# Altium schematic sheet Slave_2_relays.SchDoc
size Legal
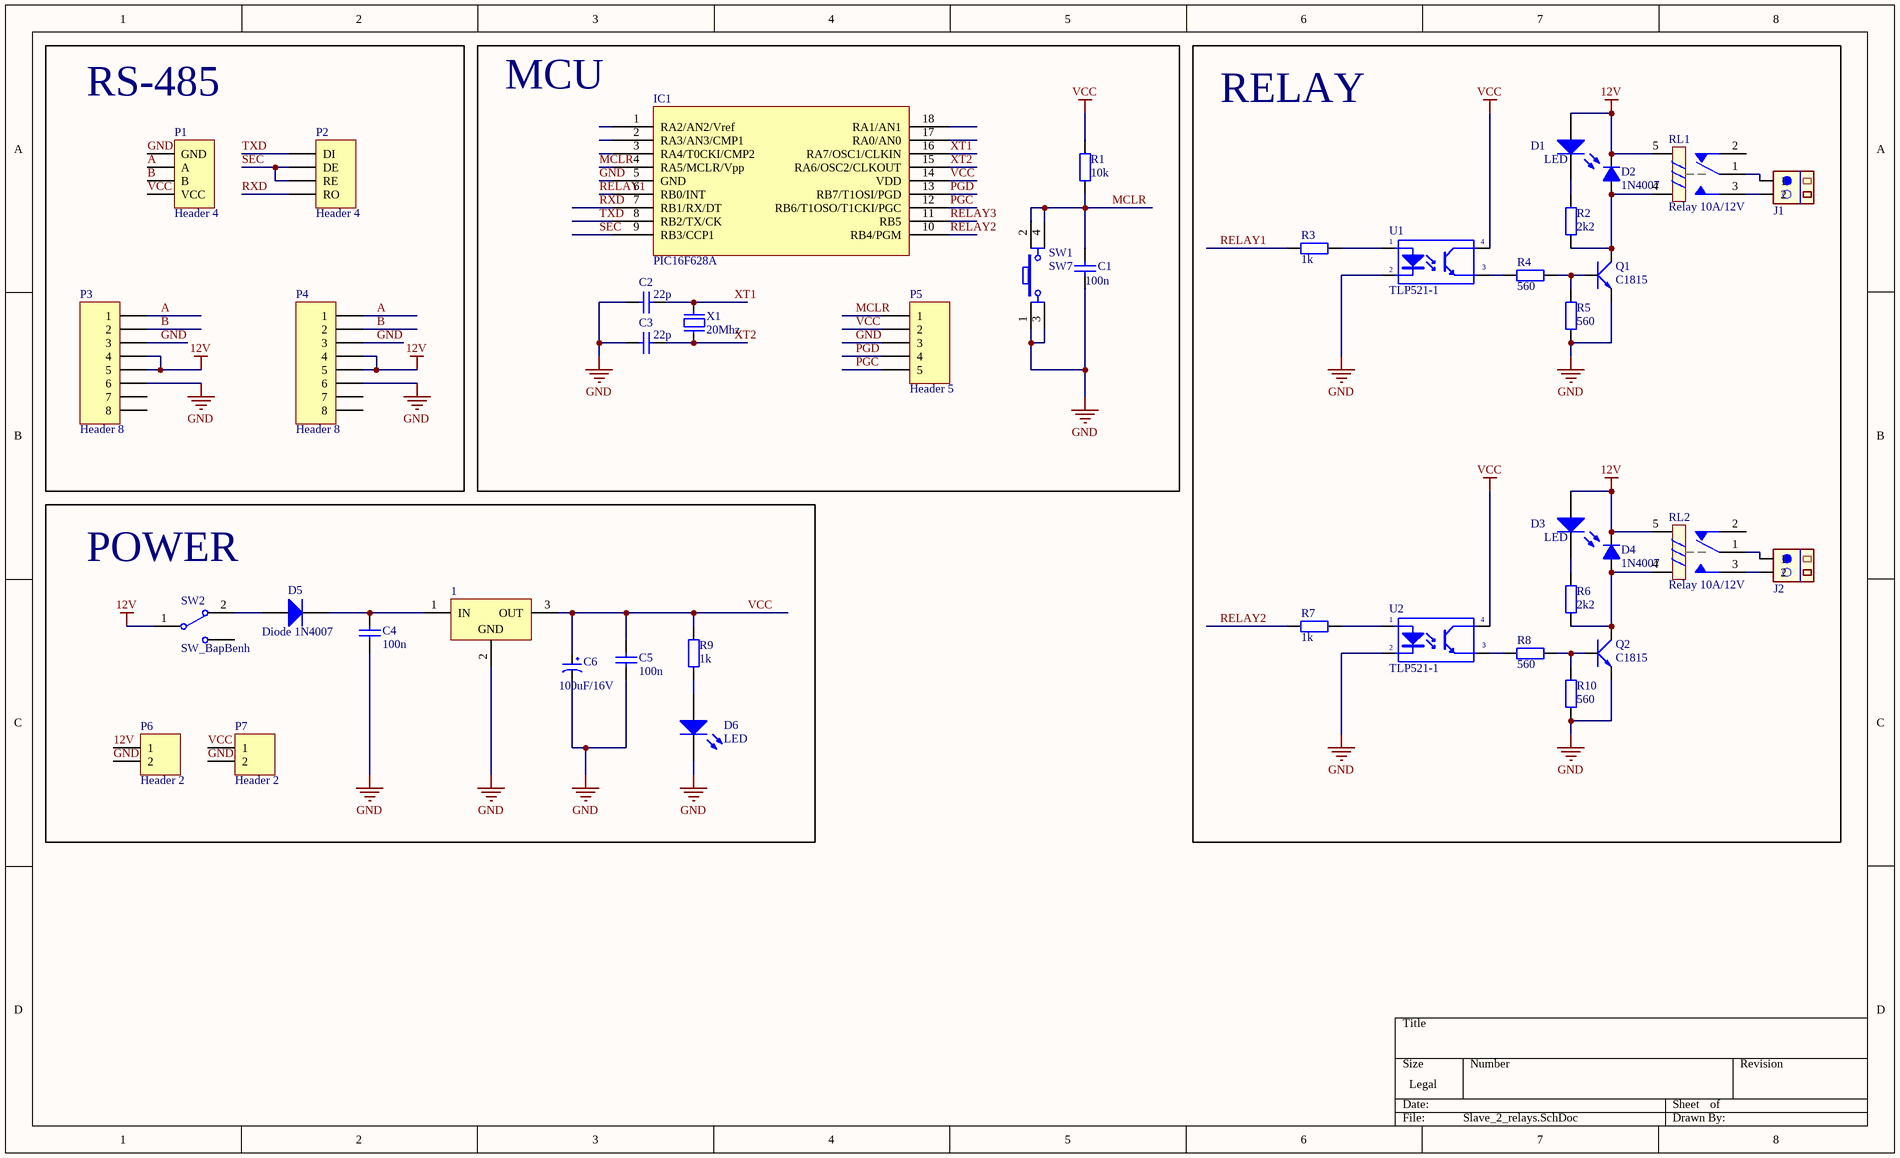
[diagram p0: Slave_2_relays.SchDoc]

## Parts
1  L78M05CP  [QTO-220]  (value not drawn)
C1  value 100n  [Cap Non-Pol 3mm]  (hidden comment: Capacitor Ceramic)
C2  value 22p  [Cap Non-Pol 3mm]  (hidden comment: Cap Non-pol)
C3  value 22p  [Cap Non-Pol 3mm]  (hidden comment: Cap Non-pol)
C4  value 100n  [Cap Non-Pol 3mm]  (hidden comment: Cap Non-pol)
C5  value 100n  [Cap Non-Pol 3mm]  (hidden comment: Cap Non-pol)
C6  100uF/16V  [CP1.5/3.4]
D1  LED  [LED-0 5mm RED]
D2  1N4007  [D1A]
D3  LED  [LED-0 5mm RED]
D4  1N4007  [D1A]
D5  Diode 1N4007  [DO-41]
D6  LED  [LED-5mm RED]
IC1  PIC16F628A  [DIP18/W0.3]
J1  CON.Domino2  [DOMINO 2B]  (value not drawn)
J2  CON.Domino2  [DOMINO 2B]  (value not drawn)
P1  Header 4  [HDR1X4]
P2  Header 4  [HDR1X4]
P3  Header 8  [RJ11]
P4  Header 8  [RJ11]
P5  Header 5  [Header 5]
P6  Header 2  [HDR1X2]
P7  Header 2  [HDR1X2]
Q1  C1815  [QTO-92]
Q2  C1815  [QTO-92]
R1  value 10k  [RESISTOR 1/4W]  (hidden comment: RES_SMD_0805)
R2  value 2k2  [RESISTOR 1/4W]  (hidden comment: RES_SMD_0805)
R3  value 1k  [RESISTOR 1/4W]  (hidden comment: RES_SMD_0805)
R4  value 560  [RESISTOR 1/4W]  (hidden comment: RES_SMD_0805)
R5  value 560  [RESISTOR 1/4W]  (hidden comment: RES_SMD_0805)
R6  value 2k2  [RESISTOR 1/4W]  (hidden comment: RES_SMD_0805)
R7  value 1k  [RESISTOR 1/4W]  (hidden comment: RES_SMD_0805)
R8  value 560  [RESISTOR 1/4W]  (hidden comment: RES_SMD_0805)
R9  value 1k  [RESISTOR 1/4W]  (hidden comment: RES_SMD_0805)
R10  value 560  [RESISTOR 1/4W]  (hidden comment: RES_SMD_0805)
RL1  Relay 10A/12V  [RL_SPDT_10A]
RL2  Relay 10A/12V  [RL_SPDT_10A]
SW1  SW7  [SW4]
SW2  SW_BapBenh  [SW_Bapbenh]
U1  TLP521-1  [DIP4/W0.3]
U2  TLP521-1  [DIP4/W0.3]
X1  20Mhz  [XT2]

## Blocks framed on the sheet
RS-485: P1-P4
MCU: C1-C3 IC1 P5 R1 SW1 X1
RELAY: D1-D4 J1 J2 Q1 Q2 R2-R8 R10 RL1 RL2 U1 U2
POWER: 1 C4-C6 D5 D6 P6 P7 R9 SW2

## Nets
12V: D1.1(A) D2.2(K) D3.1(A) D4.2(K) P3.4 P3.5 P4.4 P4.5 P6.1 RL1.5 RL2.5 SW2.1
GND: 1.2(GND) C1.1 C2.2 C3.2 C4.1 C5.1 C6.2 D6.2(K) IC1.5(GND) P1.1(GND) P3.3 P3.6 P4.3 P4.6 P5.3 P6.2 P7.2 Q1.1(E) Q2.1(E) R5.2 R10.2 SW1.1 SW1.3 U1.2(K) U2.2(K)
VCC: 1.3(OUT) C5.2 C6.1 IC1.14(VDD) P1.4(VCC) P5.2 P7.1 R1.2 R9.2 U1.4(C) U2.4(C)
A: P1.2(A) P3.1 P4.1
B: P1.3(B) P3.2 P4.2
MCLR: C1.2 IC1.4(RA5/MCLR/Vpp) P5.1 R1.1 SW1.2 SW1.4
PGC: IC1.12(RB6/T1OSO/T1CKI/PGC) P5.5
PGD: IC1.13(RB7/T1OSI/PGD) P5.4
RELAY1: IC1.6(RB0/INT) R3.2
RELAY2: IC1.10(RB4/PGM) R7.2
RELAY3: IC1.11(RB5)
RXD: IC1.7(RB1/RX/DT) P2.4(RO)
SEC: IC1.9(RB3/CCP1) P2.2(DE) P2.3(RE)
TXD: IC1.8(RB2/TX/CK) P2.1(DI)
XT1: C2.1 IC1.16(RA7/OSC1/CLKIN) X1.2
XT2: C3.1 IC1.15(RA6/OSC2/CLKOUT) X1.1
Net1_1: 1.1(IN) C4.2 D5.2(K)
NetD1_2: D1.2(K) R2.1
NetD2_1: D2.1(A) Q1.2(C) R2.2 RL1.4
NetD3_2: D3.2(K) R6.1
NetD4_1: D4.1(A) Q2.2(C) R6.2 RL2.4
NetD5_1: D5.1(A) SW2.2
NetD6_1: D6.1(A) R9.1
NetJ1_1: J1.1 RL1.1
NetJ1_2: J1.2 RL1.3
NetJ2_1: J2.1 RL2.1
NetJ2_2: J2.2 RL2.3
NetQ1_3: Q1.3(B) R4.1 R5.1
NetQ2_3: Q2.3(B) R8.1 R10.1
NetR3_1: R3.1 U1.1(A)
NetR4_2: R4.2 U1.3(E)
NetR7_1: R7.1 U2.1(A)
NetR8_2: R8.2 U2.3(E)

Not connected (* = marked no-connect by the designer): IC1 1(RA2/AN2/Vref) 2(RA3/AN3/CMP1) 3(RA4/T0CKI/CMP2) 17(RA0/AN0) 18(RA1/AN1); P3 7 8; P4 7 8; RL1 2; RL2 2

## Library data of the parts
1 = L78M05CP: Positive Voltage Regulator; Note: Tab is connected to pin 3 (GND).; Published: 24-Aug-2001; LatestRevisionDate: 17-Jul-2002; LatestRevisionNote: Re-released for DXP Platform.; DatasheetVersion: Apr-1994; PackageVersion: Jul-1998; PackageReference: ISOWATT220AB; Publisher: Altium Limited; PackageDescription: TO, Thru-Hole, Vertical, Heatsink Mounted; 3 In-Line Leads; Pitch 2.54 mm; Pin sequence 1, 3, 2; ComponentLink1Description: Manufacturer Link; ComponentLink1URL: http://www.st.com/; ComponentLink2Description: Datasheet; ComponentLink2URL: http://www.st.com/stonline/products/literature/ds/2146/l78m05c.pdf
C1 = CapSMD: Capacitor; Published: 8-Jun-2000; LatestRevisionDate: 17-Jul-2002; LatestRevisionNote: Re-released for DXP Platform.; PackageReference: RAD-0.3; Publisher: Altium Limited
C2-C5 = Cap Non-pol: Non-polarized Capacitor; Published: 8-Jun-2000; LatestRevisionDate: 17-Jul-2002; LatestRevisionNote: Re-released for DXP Platform.; PackageReference: RAD-0.3; Publisher: Altium Limited
C6 = CP3: Cap 100uF/35V - 470uF/16V; Value: 100uF/35V/50V; Description 1: 1000uF/6,3V - 470uF/16V - 330uF - 25V; Description 2: 220uF/35V - 100uF/50V - 63V - 4,7uF/200V; Description 3: 22uF => 33uF100V - 3,3uF => 4,7uF/250V; Description 4: 2,2uF =>3,3uF/350 - 2,2uF/400V - 1uF/450V
D1 D3 D6 = LED: Typical LED; Published: 8-Jun-2000; LatestRevisionDate: 08-Jul-2005; LatestRevisionNote: Mech Layer 1 removed.; PackageReference: LED-1; Publisher: Altium Limited
D2 D4 = D1A: Diode 1A; Value: 1N4007
D5 = Diode 1N4007: 1 Amp General Purpose Rectifier; Published: 8-Jun-2000; LatestRevisionDate: 17-Jul-2002; LatestRevisionNote: Re-released for DXP Platform.; DatasheetVersion: 1998; PackageVersion: Aug-1999; PackageReference: DO-41; Publisher: Altium Limited; PackageDescription: Diode, Axial; Body 5.2 x 2.7 mm (LxDia. max), Lead Dia. 0.86 mm (max); Code_JEDEC: DO-204-AL; ComponentLink1Description: Manufacturer Link; ComponentLink1URL: http://www.fairchildsemi.com/; ComponentLink2Description: Datasheet; ComponentLink2URL: http://www.fairchildsemi.com/ds/1N%2F1N4001.pdf
J1 J2 = CON.Domino2: 2 pins Domino Header; Publisher: Hoang Nguyen; ComponentLink1Description: Digikey Part link; ComponentLink2Description: Open DataSheet; ComponentLink2URL: H:\LIBRARY\LIBRARY.Datasheet\; Price: 2000VND
P1 P2 = Header 4: Header, 4-Pin; LatestRevisionDate: 17-Jul-2002; LatestRevisionNote: Re-released for DXP Platform.; Publisher: Altium Limited
P3 P4 = Header 8: Header, 8-Pin; LatestRevisionDate: 17-Jul-2002; LatestRevisionNote: Re-released for DXP Platform.; Publisher: Altium Limited
P5 = Header 5: Header, 5-Pin; LatestRevisionDate: 17-Jul-2002; LatestRevisionNote: Re-released for DXP Platform.; Publisher: Altium Limited
P6 P7 = Header 2: Header, 2-Pin; LatestRevisionDate: 17-Jul-2002; LatestRevisionNote: Re-released for DXP Platform.; Publisher: Altium Limited
Q1 Q2 = C1815: NPN 600mW, ECB; Value: C1815
R1-R10 = RES_SMD_0805: RES_0805; Published: 8-Jun-2000; LatestRevisionDate: 17-Jul-2002; LatestRevisionNote: Re-released for DXP Platform.; PackageReference: AXIAL-0.4; Publisher: Altium Limited
RL1 RL2 = Relay 1: Relay SPDT,10A - 12VDC 5 Pin; Value: Relay SPDT, 10A, 12V
SW1 = SW4: Switch button 4 pin; Value: Button chip 4 pin
U1 U2 = TLP521-1: Single Opto; Value: TLP5211
X1 = XT2: Crystal For all Crystal 2pin.; Value: 4Mhz